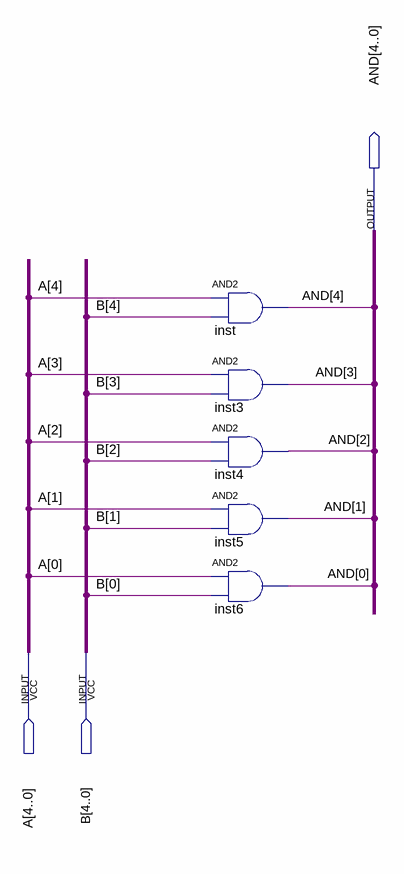
[diagram p0: schematic sheet]
// Quartus schematic a_and_b.bdf as structural Verilog: 5 symbols, 3 pins
module a_and_b (
  input  [4:0] A,
  input  [4:0] B,
  output [4:0] AND
);

  and inst (AND[4], A[4], B[4]);
  and inst3 (AND[3], A[3], B[3]);
  and inst4 (AND[2], A[2], B[2]);
  and inst5 (AND[1], A[1], B[1]);
  and inst6 (AND[0], A[0], B[0]);
endmodule
